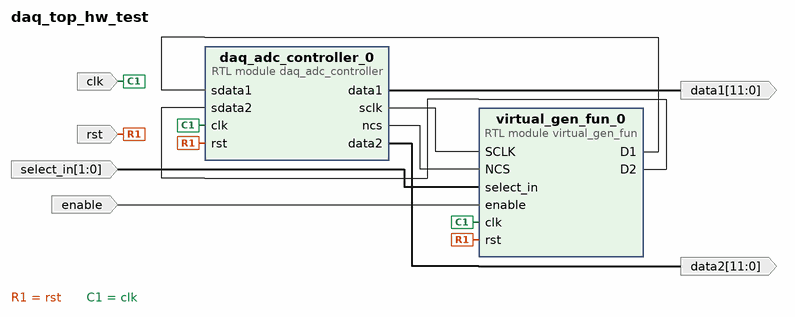
[diagram p0: block diagram of the top level]
# Vivado block design daq_top_hw_test, xc7a100tcsg324-1, Vivado 2019.1
create_bd_design daq_top_hw_test

create_bd_port -dir I rst
create_bd_port -dir I clk
create_bd_port -dir I -from 1 -to 0 select_in
create_bd_port -dir I enable
create_bd_port -dir O -from 11 -to 0 data1
create_bd_port -dir O -from 11 -to 0 data2

create_bd_cell -type module -reference daq_adc_controller daq_adc_controller_0
create_bd_cell -type module -reference virtual_gen_fun virtual_gen_fun_0

# ---- connections ----

connect_bd_net [get_bd_ports rst] [get_bd_pins daq_adc_controller_0/rst] [get_bd_pins virtual_gen_fun_0/rst]
connect_bd_net [get_bd_ports clk] [get_bd_pins daq_adc_controller_0/clk] [get_bd_pins virtual_gen_fun_0/clk]
connect_bd_net [get_bd_pins virtual_gen_fun_0/D1] [get_bd_pins daq_adc_controller_0/sdata1]
connect_bd_net [get_bd_pins virtual_gen_fun_0/D2] [get_bd_pins daq_adc_controller_0/sdata2]
connect_bd_net [get_bd_ports select_in] [get_bd_pins virtual_gen_fun_0/select_in]
connect_bd_net [get_bd_ports enable] [get_bd_pins virtual_gen_fun_0/enable]
connect_bd_net [get_bd_pins daq_adc_controller_0/sclk] [get_bd_pins virtual_gen_fun_0/SCLK]
connect_bd_net [get_bd_pins daq_adc_controller_0/ncs] [get_bd_pins virtual_gen_fun_0/NCS]
connect_bd_net [get_bd_pins daq_adc_controller_0/data1] [get_bd_ports data1]
connect_bd_net [get_bd_pins daq_adc_controller_0/data2] [get_bd_ports data2]

validate_bd_design
save_bd_design
